# EasyEDA Pro project ProProject_STM32 2.4G无线遥控小车_2023-08-27.epro

# Schematic 遥控板（发送端）
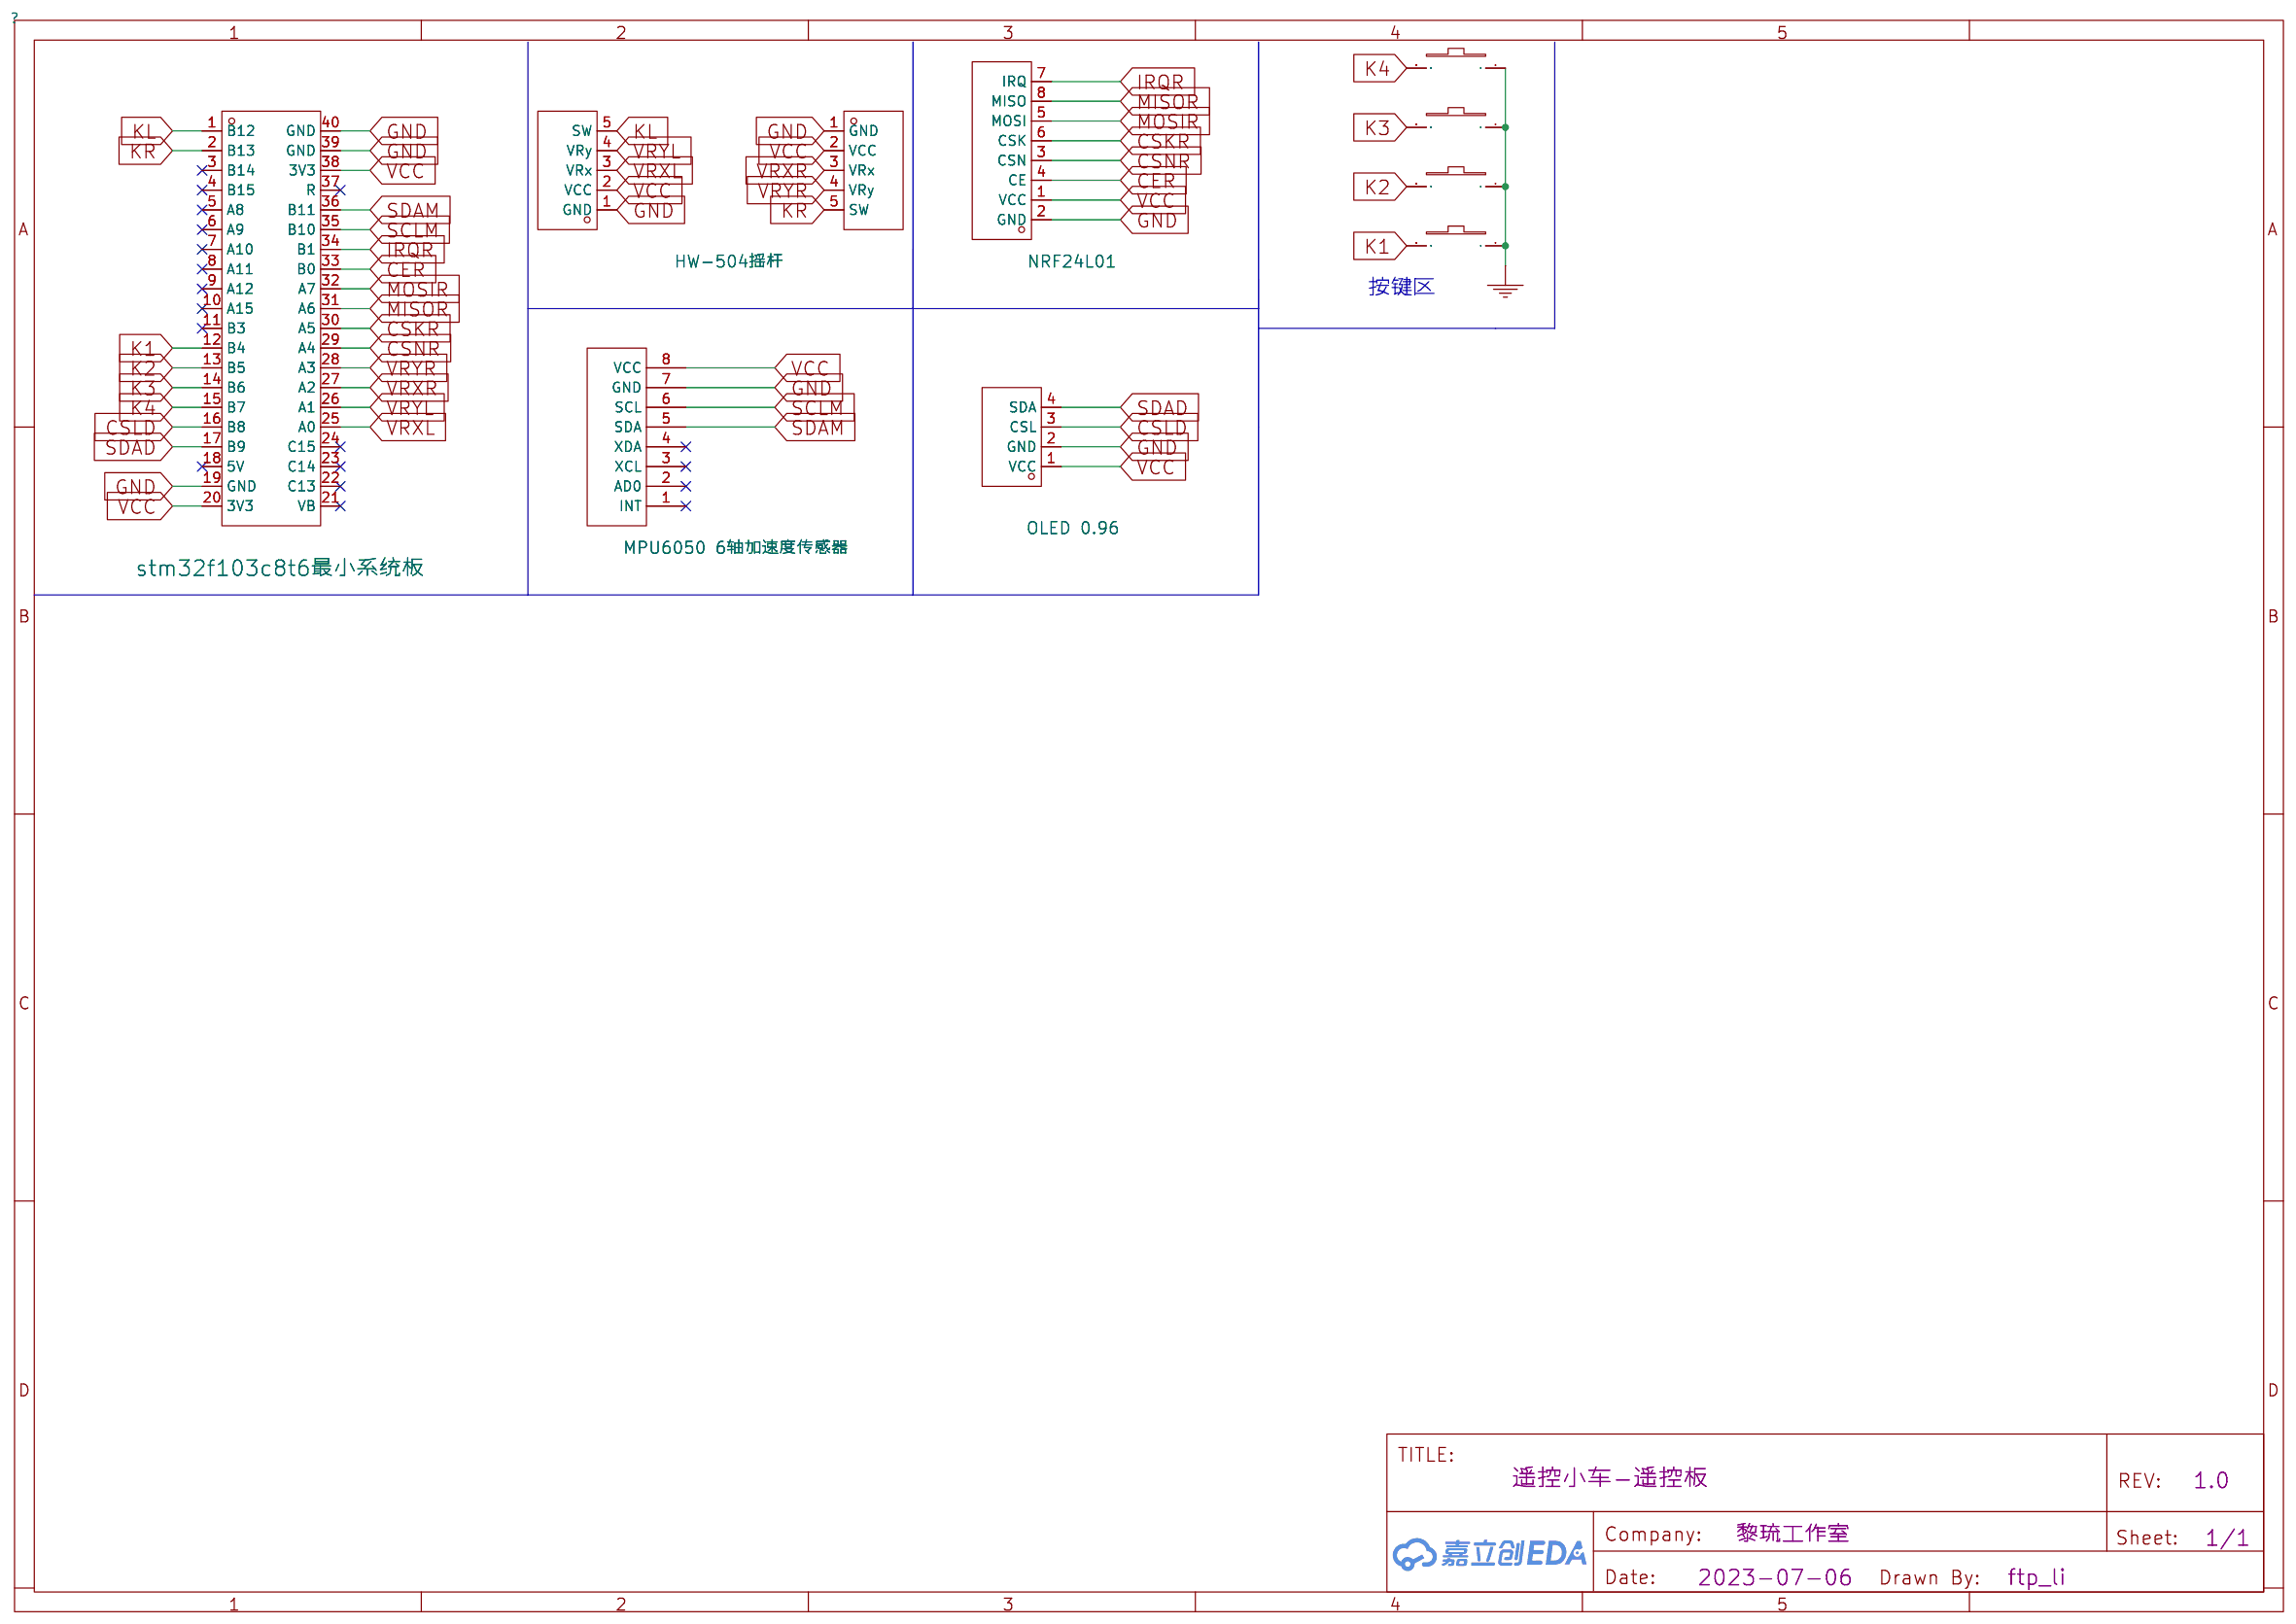
[diagram p0: schematic sheet]

## Parts
U3  stm32f103c8t6最小系统板  [STM32F103C8T6]
U7  HW-504摇杆  [5P]
U8  HW-504摇杆  [5P]
U9  MPU6050 6轴加速度传感器  [COMM-TH_MPU6050M]
U10  NRF24L01  [WIRELM-SMD_AI_NRF24L01]
U16  6*6 按键 微动开关  [DIP-6*6*7.5]
U17  6*6 按键 微动开关  [DIP-6*6*7.5]
U18  6*6 按键 微动开关  [DIP-6*6*7.5]
U21  OLED 0.96  [OLED-TH12864]
U24  6*6 按键 微动开关  [DIP-6*6*7.5]

## Library data of the parts
U3 = stm32f103c8t6最小系统板
U7 U8 = HW-504摇杆
U9 = MPU6050 6轴加速度传感器
U10 = NRF24L01
U16-U18 U24 = 6*6 按键 微动开关
U21 = OLED 0.96

## Nets
GND: U3.19(GND) U3.39(GND) U3.40(GND) U7.1(GND) U8.1(GND) U9.7(GND) U10.2(GND) U16.1 U17.1 U18.1 U21.2(GND) U24.1
VCC: U3.20(3V3) U3.38(3V3) U7.2(VCC) U8.2(VCC) U9.8(VCC) U10.1(VCC) U21.1(VCC)
CER: U3.33(B0) U10.4(CE)
CSKR: U3.30(A5) U10.6(CSK)
CSLD: U3.16(B8) U21.3(CSL)
CSNR: U3.29(A4) U10.3(CSN)
IRQR: U3.34(B1) U10.7(IRQ)
K1: U3.12(B4) U24.2
K2: U3.13(B5) U16.2
K3: U3.14(B6) U17.2
K4: U3.15(B7) U18.2
KL: U3.1(B12) U7.5(SW)
KR: U3.2(B13) U8.5(SW)
MISOR: U3.31(A6) U10.8(MISO)
MOSIR: U3.32(A7) U10.5(MOSI)
SCLM: U3.35(B10) U9.6(SCL)
SDAD: U3.17(B9) U21.4(SDA)
SDAM: U3.36(B11) U9.5(SDA)
VRXL: U3.25(A0) U7.3(VRx)
VRXR: U3.27(A2) U8.3(VRx)
VRYL: U3.26(A1) U7.4(VRy)
VRYR: U3.28(A3) U8.4(VRy)

Not connected (* = marked no-connect by the designer): U3 3(B14)* 4(B15)* 5(A8)* 6(A9)* 7(A10)* 8(A11)* 9(A12)* 10(A15)* 11(B3)* 18(5V)* 21(VB)* 22(C13)* 23(C14)* 24(C15)* 37(R)*; U9 1(INT)* 2(AD0)* 3(XCL)* 4(XDA)*

## Notes on the sheet
- 按键区

# Schematic 车载板（接收端）
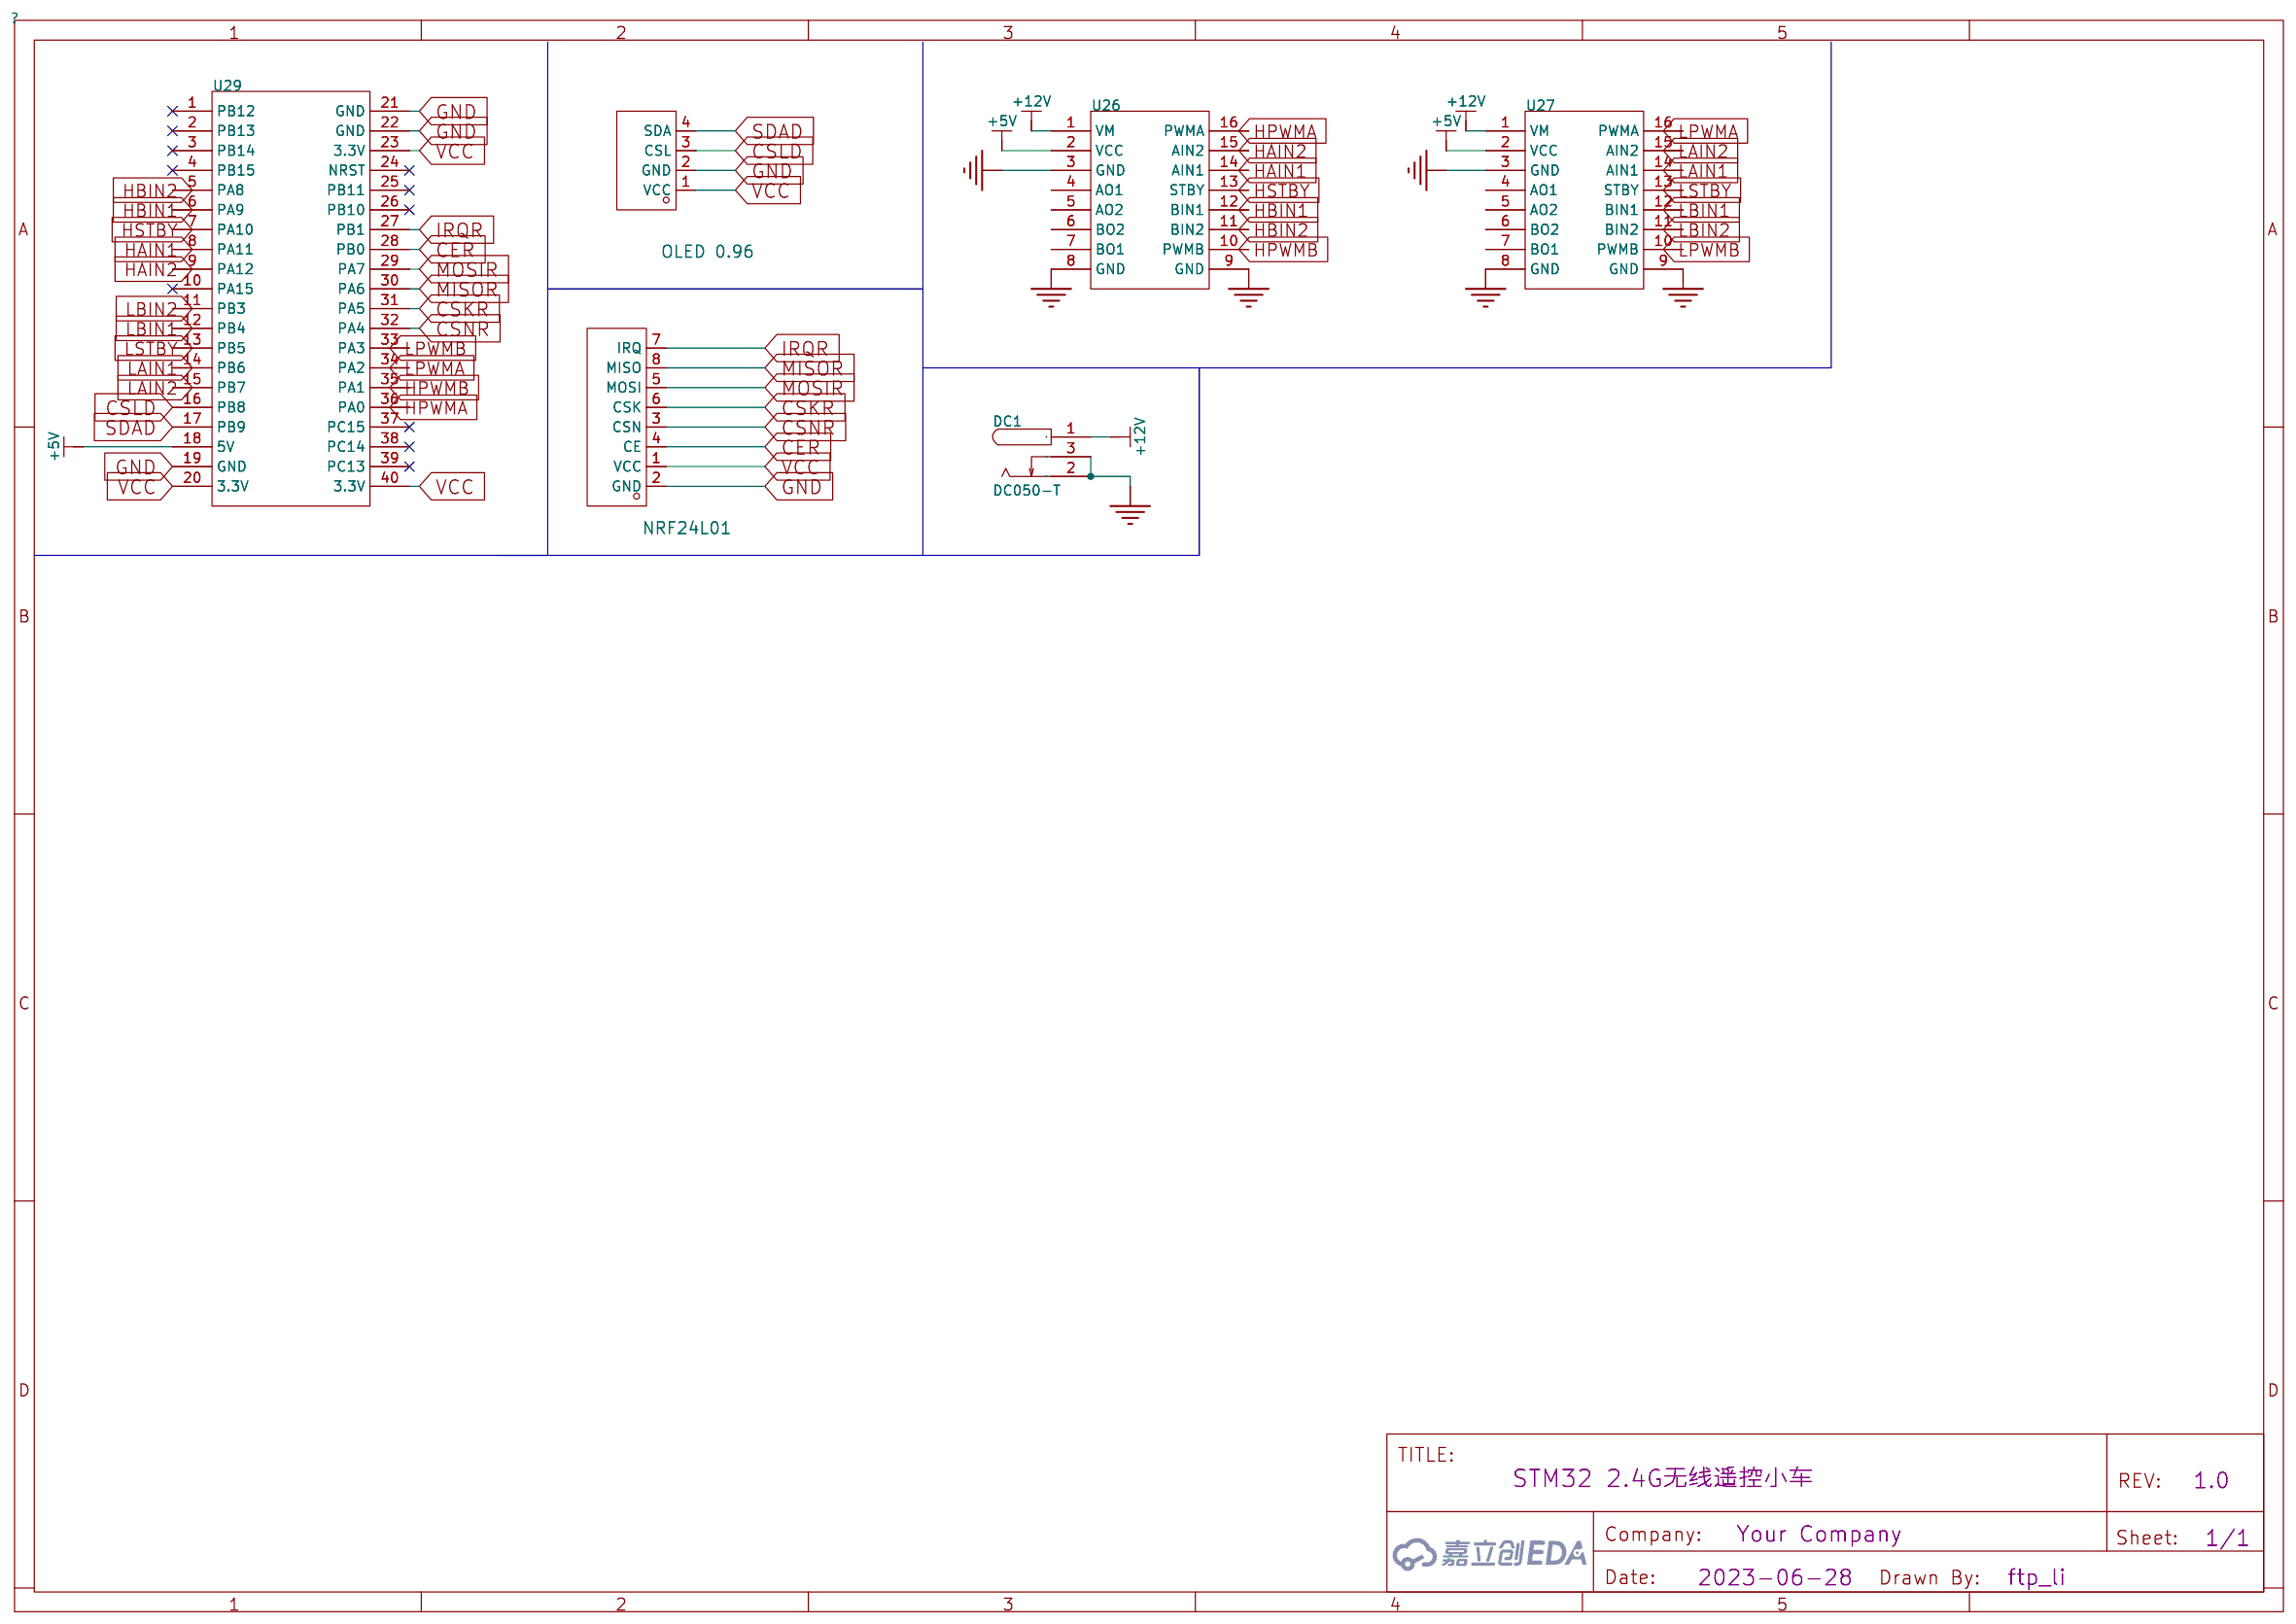
[diagram p1: schematic sheet]

## Parts
DC1  DC050-T  [DC-IN_DC050-T]
U4  NRF24L01  [nrf24l01]
U6  OLED 0.96  [OLED_0.96_IIC_1]
U26  -  [TB6612]
U27  -  [TB6612]
U29  -  [STM32F103C8T6]

## Library data of the parts
DC1 = DC050-T: 连接器类型:DC电源插座;安装方式:卧贴;触点内径:-;触点外径:6.4mm;额定电流:4A;额定电压:16V;工作温度范围:-;; LCSC Part Name: DC电源插座 外径:6.4mm 铜材质; Supplier Part: C431534; Manufacturer: SHOU HAN(首韩); Supplier Footprint: SMD; JLCPCB Part Class: 扩展库; Datasheet: https://atta.szlcsc.com/upload/public/pdf/source/20190925/C431534_67EA3B20454E00D5CD394807B04C56FF.pdf; Supplier: LCSC; Connector Type: DC电源插座; Mounting Style: 卧贴; Outside Contact Diameter: 6.4mm; Current Rating (Max): 4A; Voltage Rating (Max): 16V
U4 = NRF24L01
U6 = OLED 0.96
U26 U27 = TB6612
U29 = STM32F103C8T6最小系统

## Nets
+5V: U26.2(VCC) U27.2(VCC) U29.18(5V)
+12V: DC1.1 U26.1(VM) U27.1(VM)
GND: DC1.2 DC1.3 U4.2(GND) U6.2(GND) U26.3(GND) U26.8(GND) U26.9(GND) U27.3(GND) U27.8(GND) U27.9(GND) U29.19(GND) U29.21(GND) U29.22(GND)
VCC: U4.1(VCC) U6.1(VCC) U29.20(3.3V) U29.23(3.3V) U29.40(3.3V)
CER: U4.4(CE) U29.28(PB0)
CSKR: U4.6(CSK) U29.31(PA5)
CSLD: U6.3(CSL) U29.16(PB8)
CSNR: U4.3(CSN) U29.32(PA4)
HAIN1: U26.14(AIN1) U29.8(PA11)
HAIN2: U26.15(AIN2) U29.9(PA12)
HBIN1: U26.12(BIN1) U29.6(PA9)
HBIN2: U26.11(BIN2) U29.5(PA8)
HPWMA: U26.16(PWMA) U29.36(PA0)
HPWMB: U26.10(PWMB) U29.35(PA1)
HSTBY: U26.13(STBY) U29.7(PA10)
IRQR: U4.7(IRQ) U29.27(PB1)
LAIN1: U27.14(AIN1) U29.14(PB6)
LAIN2: U27.15(AIN2) U29.15(PB7)
LBIN1: U27.12(BIN1) U29.12(PB4)
LBIN2: U27.11(BIN2) U29.11(PB3)
LPWMA: U27.16(PWMA) U29.34(PA2)
LPWMB: U27.10(PWMB) U29.33(PA3)
LSTBY: U27.13(STBY) U29.13(PB5)
MISOR: U4.8(MISO) U29.30(PA6)
MOSIR: U4.5(MOSI) U29.29(PA7)
SDAD: U6.4(SDA) U29.17(PB9)

Not connected (* = marked no-connect by the designer): U26 4(AO1) 5(AO2) 6(BO2) 7(BO1); U27 4(AO1) 5(AO2) 6(BO2) 7(BO1); U29 1(PB12)* 2(PB13)* 3(PB14)* 4(PB15)* 10(PA15)* 24(NRST)* 25(PB11)* 26(PB10)* 37(PC15)* 38(PC14)* 39(PC13)*

# Board PCB遥控板（发送端）
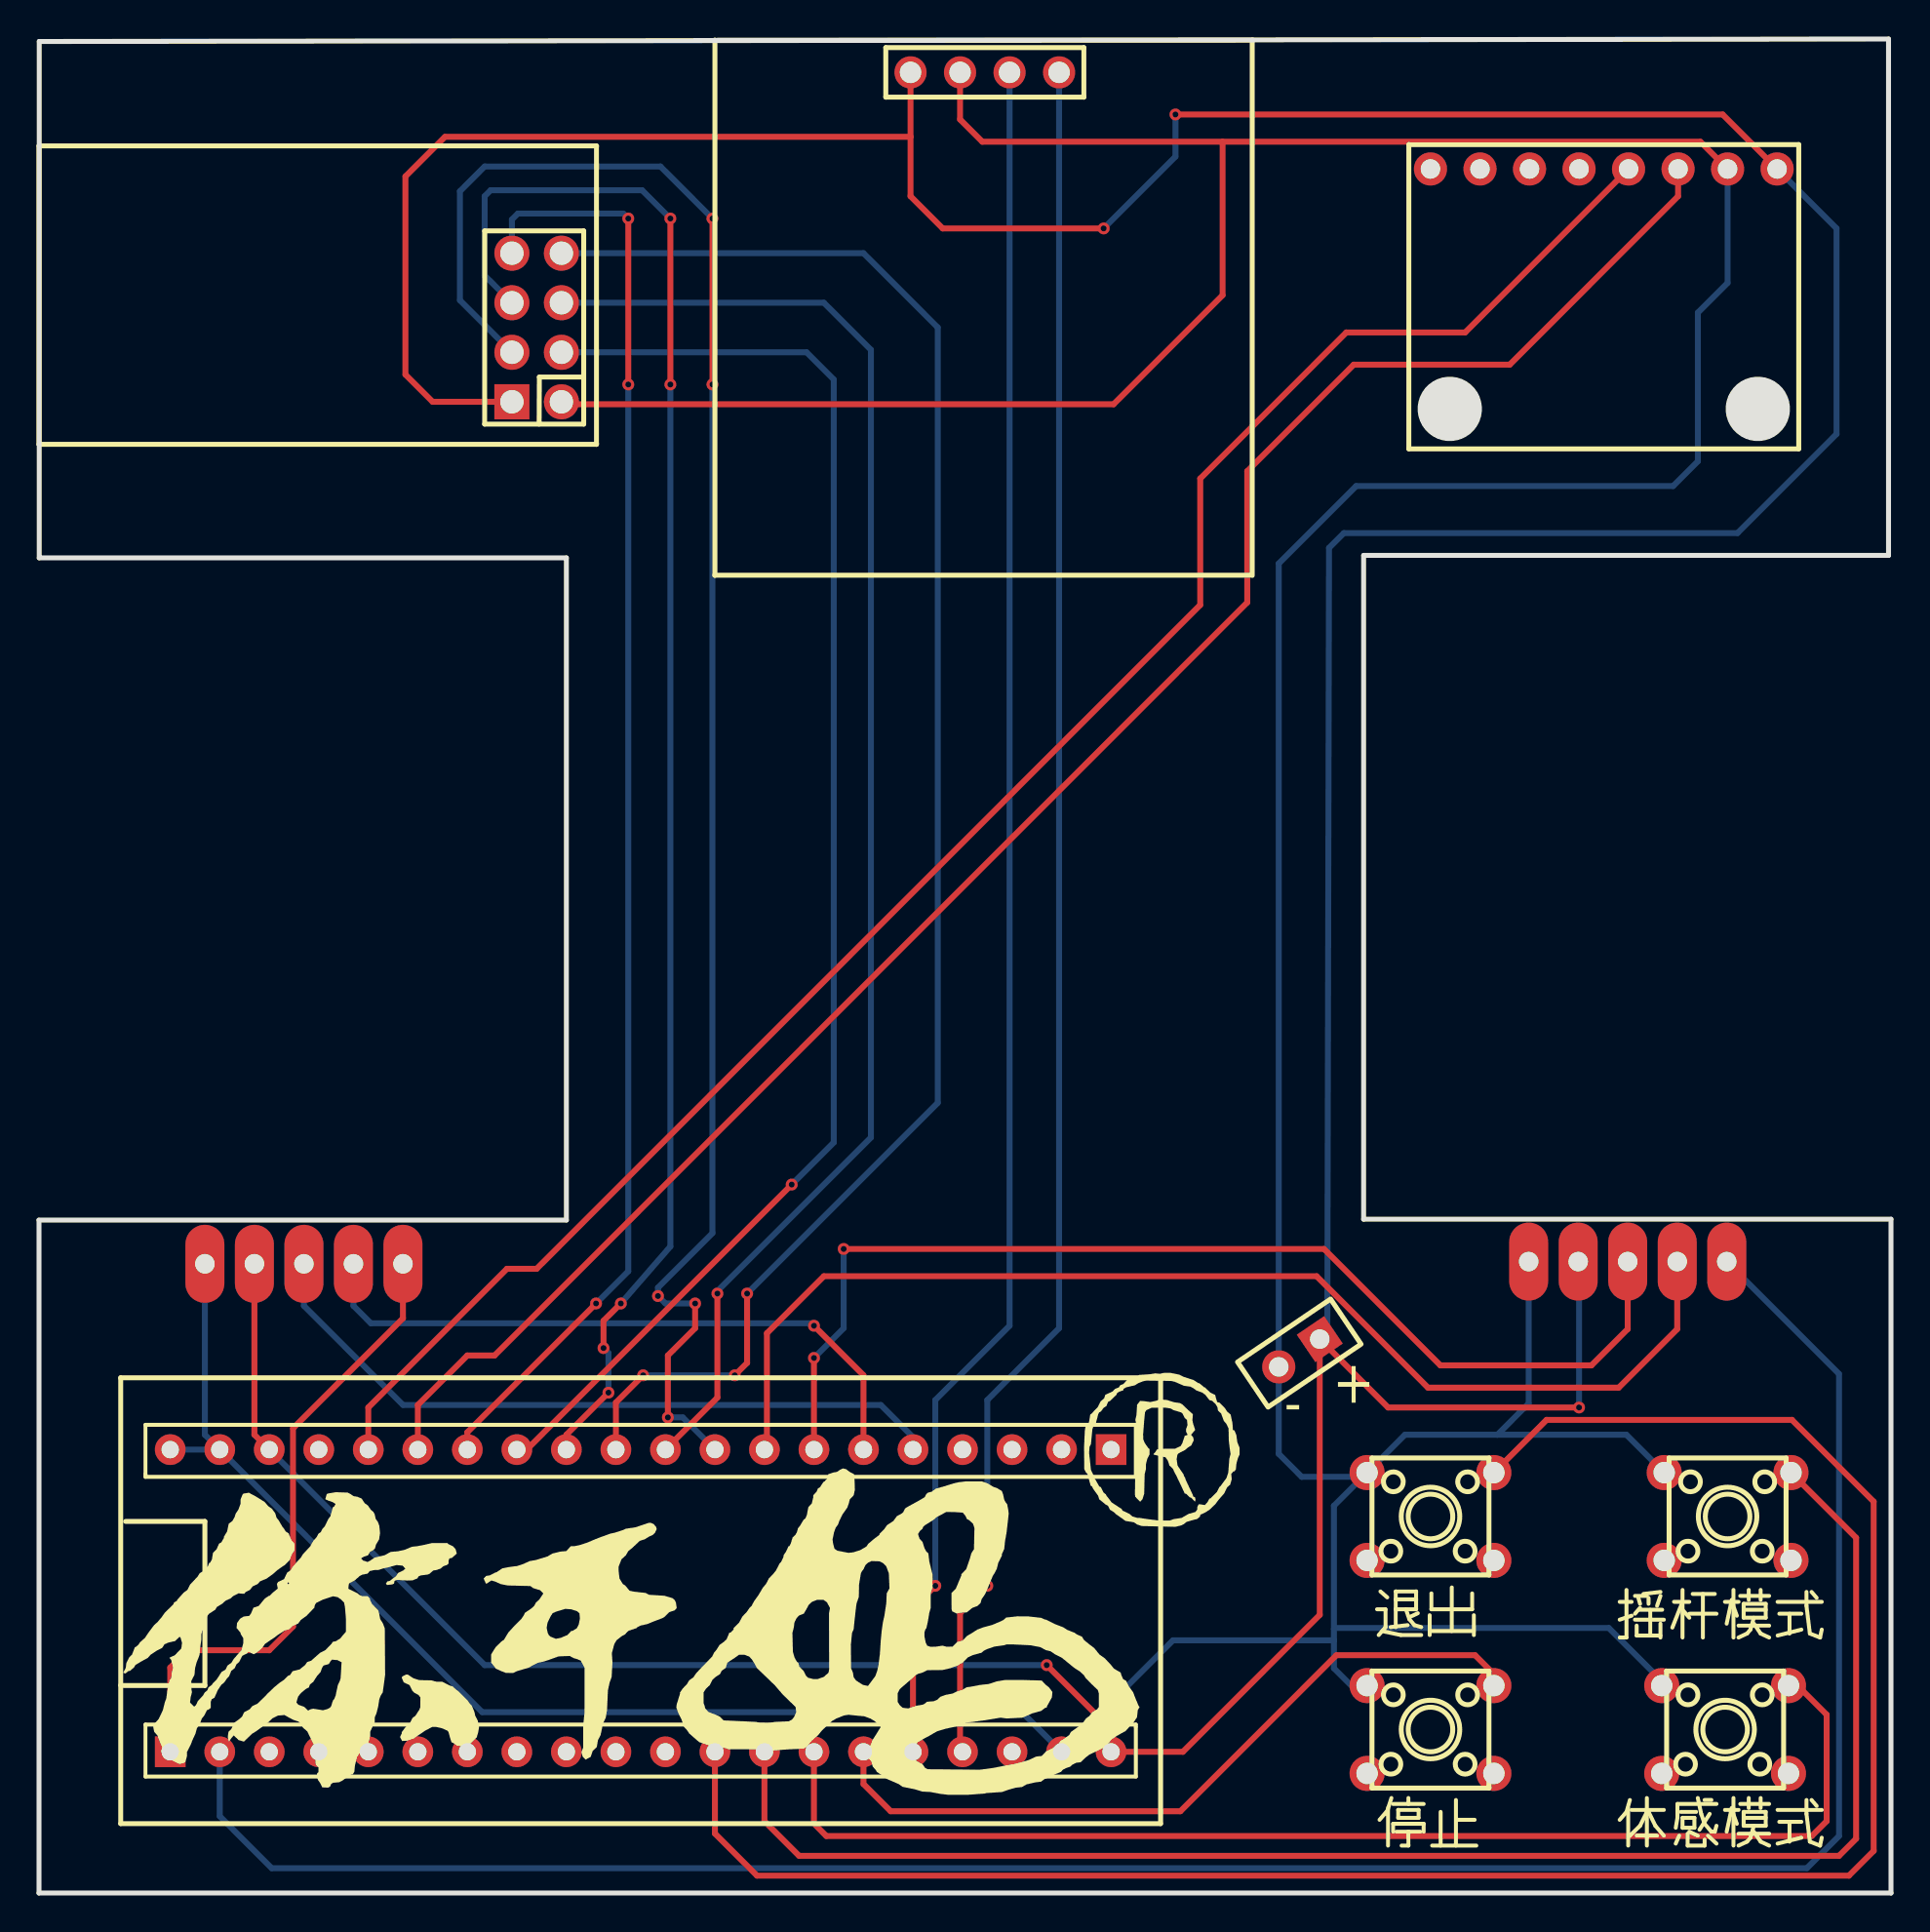
[diagram p2: board, top side]
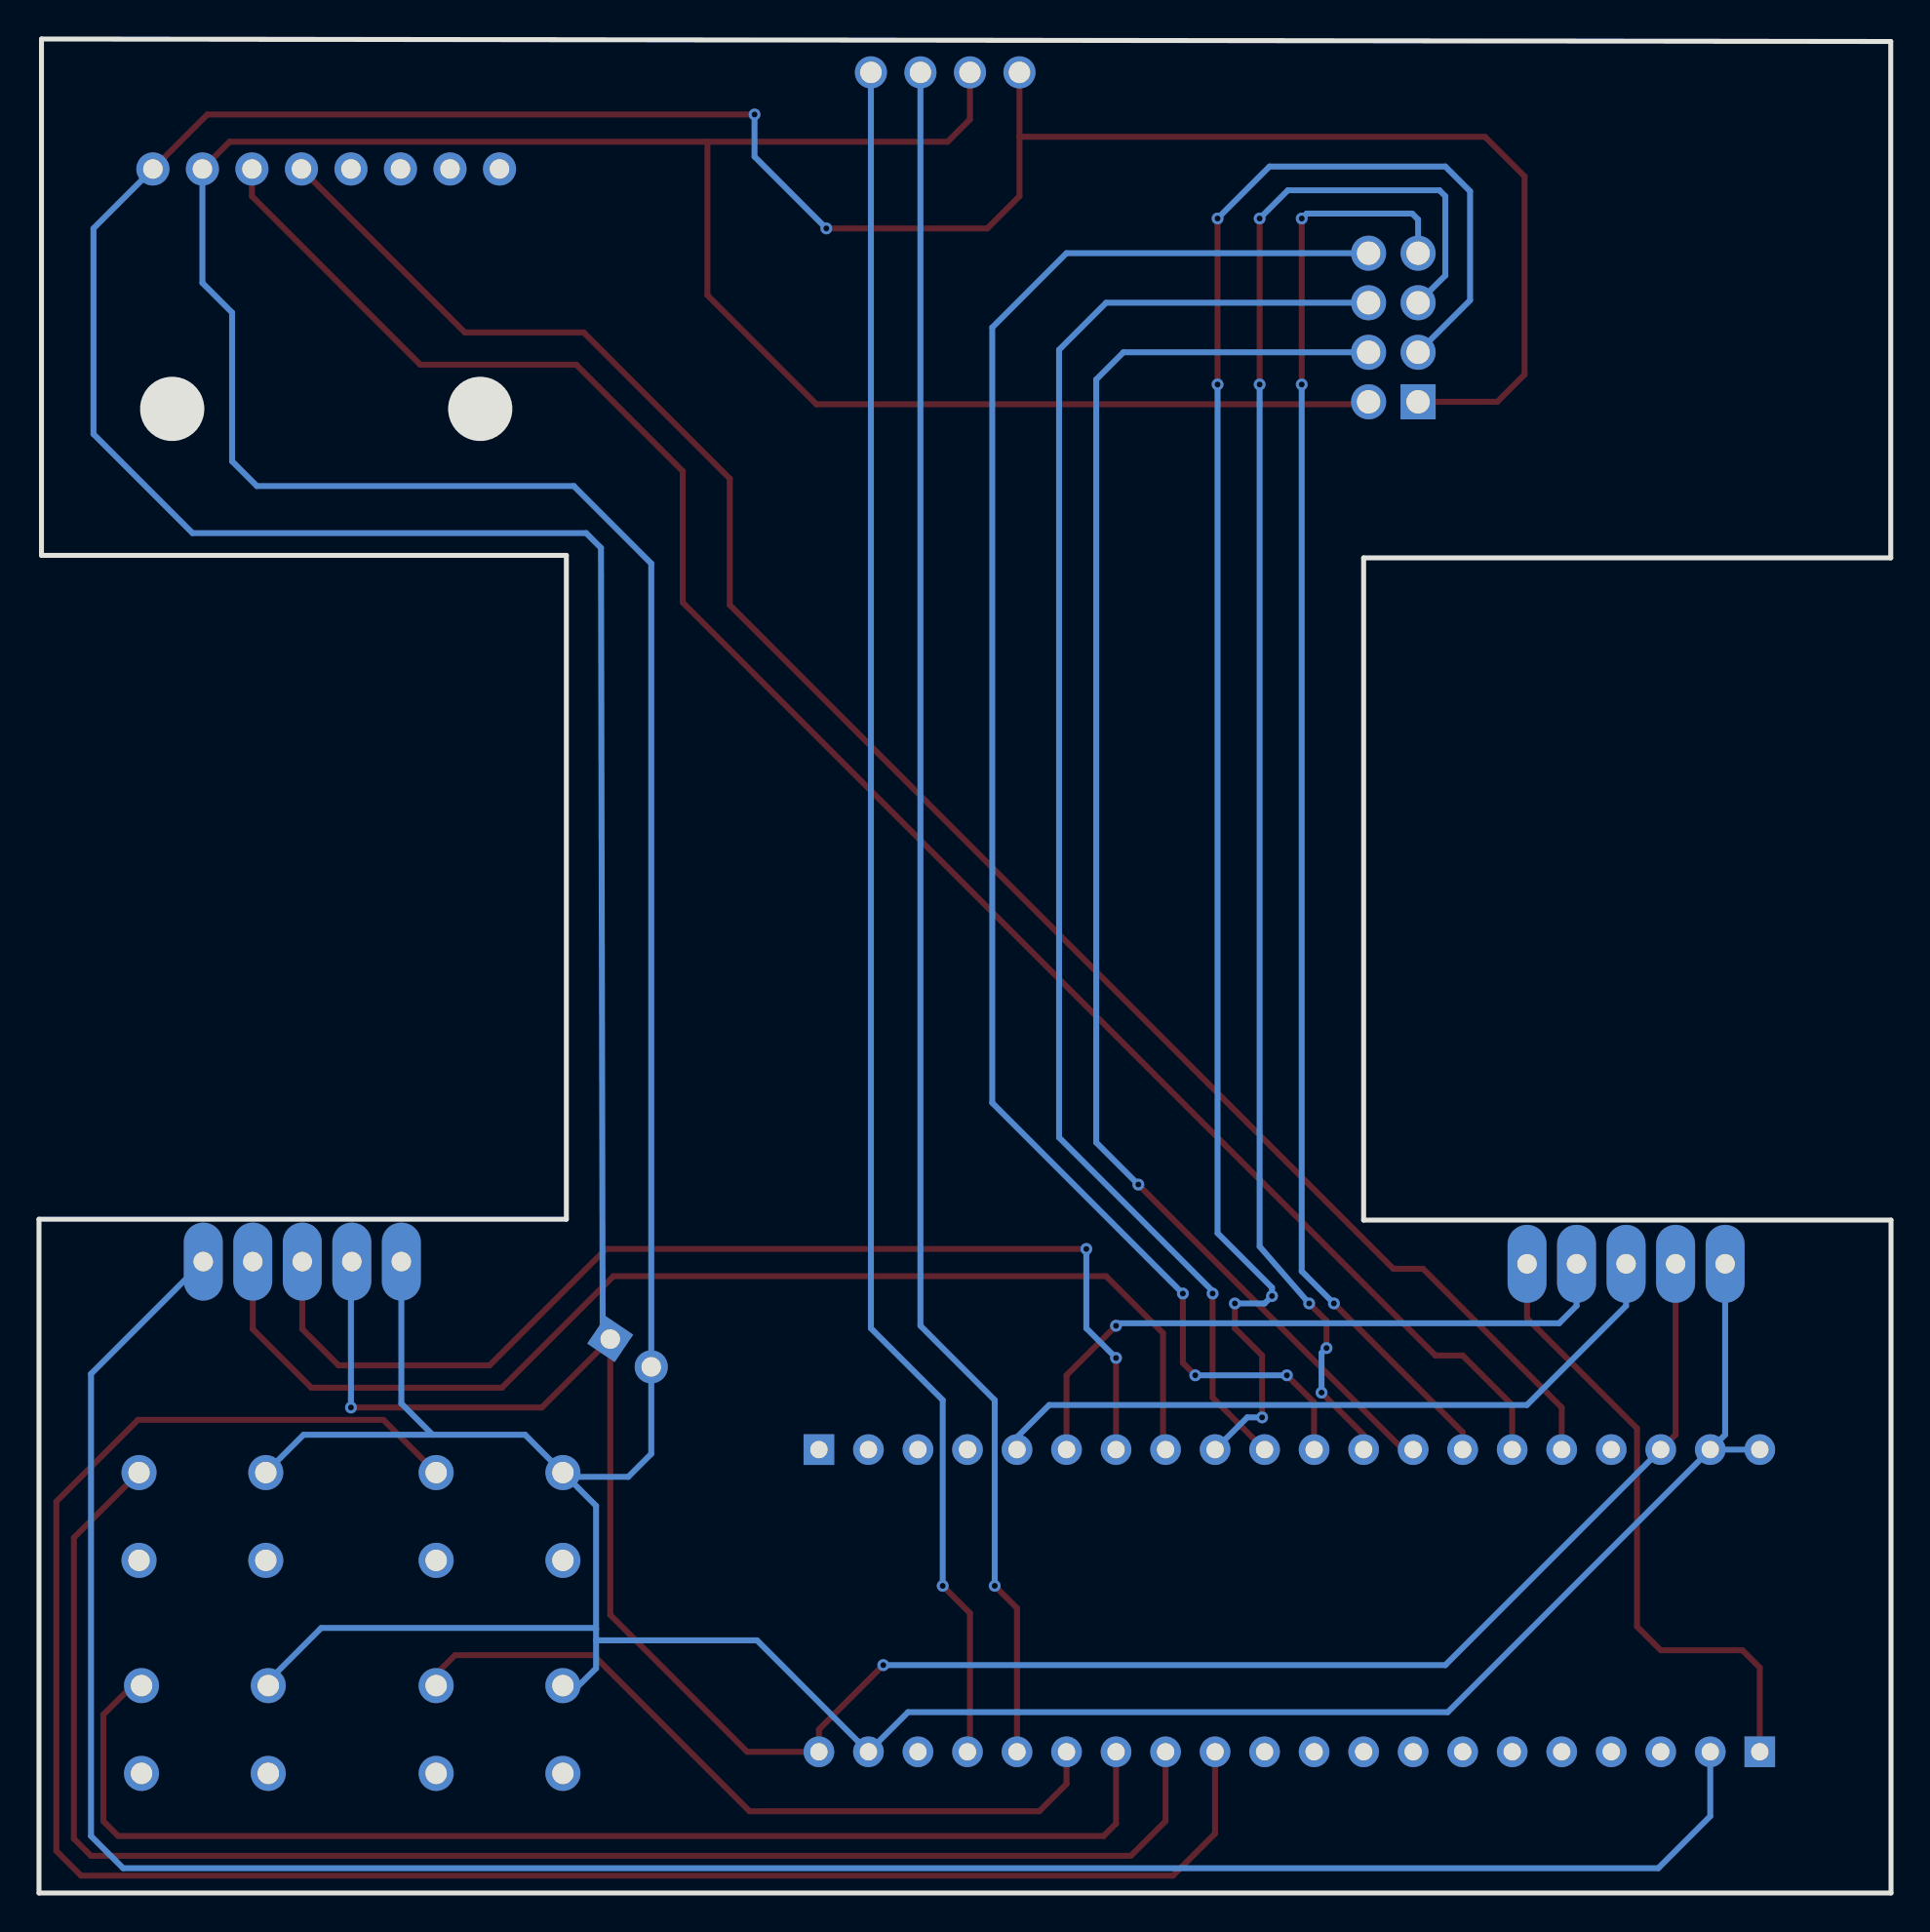
[diagram p3: board, bottom side, seen from below]

Outline 95 x 95.06 mm; copper layers: Top Layer, Bottom Layer. Coordinates in mm from the lower left corner of the outline.
Outline path: 0,34.5 27.05,34.5 27.05,68.45 0.01,68.45 0.01,94.93 94.87,95.06 94.87,68.58 67.94,68.58 67.94,34.54 95,34.54 95,0 0,0 0,34.5
Stack: Top Layer 0.035mm / Dielectric1 1.51mm FR4 er 4.5 / Bottom Layer 0.035mm

## Design rules (mm)
spacing Default (default): track to track 0.152, other pairs 0 to 0.152
track width Default (default): min 0.305, default 0.305, max 25.4
differential pair differentialPair (default): width min 0.127, default 0.254, max 2.54; gap min 0.152, default 0.152
via Default (default): diameter min 0.61, default 0.61, max 100.025; hole min 0.305, default 0.305, max 59.995

## Placement (name value [footprint] x y rotation side)
H1  -  [HDR-TH_2P-P2.54-V-F]  64.64 27.69 214.1 top
U3  stm32f103c8t6最小系统板  [STM32F103C8T6]  31.5 15.49 90 top
U7  HW-504摇杆  [5P]  13.59 32.26 90 top
U8  HW-504摇杆  [5P]  81.49 32.37 90 top
U9  MPU6050 6轴加速度传感器  [COMM-TH_MPU6050M]  80.26 88.39 0 top
U10  NRF24L01  [WIRELM-SMD_AI_NRF24L01]  25.53 80.26 180 top
U16  6*6 按键 微动开关  [DIP-6*6*7.5]  86.61 19.3 0 top
U17  6*6 按键 微动开关  [DIP-6*6*7.5]  86.49 8.38 0 top
U18  6*6 按键 微动开关  [DIP-6*6*7.5]  71.37 8.38 0 top
U21  OLED 0.96  [OLED-TH12864]  48.51 93.34 0 top
U24  6*6 按键 微动开关  [DIP-6*6*7.5]  71.37 19.3 0 top

## Footprints (pads in the part's own frame, mm; a bottom-side part is the same pattern mirrored in y, then rotated)
5P
  oval 4x2 hole 1x1: 1(0,5.08) 2(0,2.54) 3(0,0) 4(0,-2.54) 5(0,-5.08)
COMM-TH_MPU6050M
  round 1.7 hole 1: 1(-8.89,0) 2(-6.35,0) 3(-3.81,0) 4(-1.27,0) 5(1.27,0) 6(3.81,0) 7(6.35,0) 8(8.89,0)
DIP-6*6*7.5
  round 1.8 hole 1.1: 1(-3.251,2.251) 2(3.251,2.251) 3(-3.251,-2.251) 4(3.251,-2.251)
HDR-TH_2P-P2.54-V-F
  rect 1.7x1.7 hole 1: 1(-1.27,0)
  round 1.7 hole 1: 2(1.27,0)
OLED-TH12864
  round 1.65 hole 1.1: 1(-3.81,0) 2(-1.27,0) 3(1.27,0) 4(3.81,0)
STM32F103C8T6
  rect 1.575x1.575 hole 0.889: 1(-8.255,24.765) 21(7.239,-23.495)
  round 1.575 hole 0.889: 2(-8.255,22.225) 3(-8.255,19.685) 4(-8.255,17.145) 5(-8.255,14.605) 6(-8.255,12.065) 7(-8.255,9.525) 8(-8.255,6.985) 9(-8.255,4.445) 10(-8.255,1.905) 11(-8.255,-0.635) 12(-8.255,-3.175) 13(-8.255,-5.715) 14(-8.255,-8.255) 15(-8.255,-10.795) 16(-8.255,-13.335) 17(-8.255,-15.875) 18(-8.255,-18.415) 19(-8.255,-20.955) 20(-8.255,-23.495) 22(7.239,-20.955) 23(7.239,-18.415) 24(7.239,-15.875) 25(7.239,-13.335) 26(7.239,-10.795) 27(7.239,-8.255) 28(7.239,-5.715) 29(7.239,-3.175) 30(7.239,-0.635) 31(7.239,1.905) 32(7.239,4.445) 33(7.239,6.985) 34(7.239,9.525) 35(7.239,12.065) 36(7.239,14.605) 37(7.239,17.145) 38(7.239,19.685) 39(7.239,22.225) 40(7.239,24.765)
WIRELM-SMD_AI_NRF24L01
  rect 1.8x1.8 hole 1.2: 1(1.27,3.808)
  round 1.8 hole 1.2: 2(-1.27,3.81) 3(1.27,1.27) 4(-1.27,1.27) 5(1.27,-1.27) 6(-1.27,-1.27) 7(1.27,-3.81) 8(-1.27,-3.81)

## Nets
As in the schematic, except:
GND: H1.2 U3.19 U3.39 U3.40 U7.1 U8.1 U9.7 U10.2 U16.1 U17.1 U18.1 U21.2 U24.1
VCC: H1.1 U3.20 U3.38 U7.2 U8.2 U9.8 U10.1 U21.1

Pads without a net: U3 3 4 5 6 7 8 9 10 11 18 21 22 23 24 37; U9 1 2 3 4; U16 3 4; U17 3 4; U18 3 4; U24 3 4

## Via types
v1: diameter 0.61, hole 0.305, Top Layer to Bottom Layer, 27 vias

## Routing (per net, layer and track width the routed paths; a pad name or vN(x,y) marks a point on that pad's centre or on a via; arc(x,y) is an arc through that point)
GND: length 312.7
  Top Layer w0.305: 60.71,89.79 48.39,89.79 47.24,90.93 U21.2 ; 60.71,89.79 60.71,81.92 55.12,76.33 26.92,76.33 U10.2 ; 60.71,89.79 85.22,89.79 U9.7
  Bottom Layer w0.305: 66.42,12.95 58.17,12.95 U3.19 50.42,9.27 22.73,9.27 U3.39 ; 66.42,12.95 66.42,11.52 67.69,10.25 68.12,10.25 ; 66.42,12.95 66.42,13.53 ; U7.1 8.51,23.5 U3.39 ; U3.39 U3.40 ; 74.8,23.5 81.42,23.5 U16.1 ; 74.8,23.5 76.41,25.1 U8.1 ; 74.8,23.5 70.06,23.5 U24.1 67.9,21.34 ; U9.7 86.61,82.55 85.09,81.03 85.09,73.41 83.82,72.14 67.56,72.14 63.59,68.16 H1.2 63.59,22.52 64.77,21.34 67.9,21.34 ; 67.9,21.34 66.42,19.85 66.42,13.53 ; 66.42,13.53 66.48,13.59 80.52,13.59 83.36,10.74 83.36,10.63
VCC: length 293.4
  Top Layer w0.305: 44.7,90.04 20.83,90.04 18.8,88.01 18.8,77.85 20.19,76.46 U10.1 ; 44.7,90.04 44.7,87 46.35,85.34 v1(54.61,85.34) ; 44.7,90.04 U21.1 ; v1(78.99,24.89) 69.2,24.89 65.69,28.4 65.69,14.26 58.67,7.24 U3.20 54.99,8.38 v1(51.69,11.68) ; U3.38 11.05,23.5 U7.2 ; v1(58.29,91.19) 86.36,91.19 U9.8
  Bottom Layer w0.305: U8.2 78.99,32.33 v1(78.99,24.89) ; U9.8 92.2,85.34 92.2,74.8 87.12,69.72 66.93,69.72 66.17,68.96 66.08,28.78 65.69,28.4 ; v1(51.69,11.68) 22.86,11.68 U3.38 ; v1(58.29,91.19) 58.29,89.03 v1(54.61,85.34)
CER: length 76.4
  Top Layer w0.305: v1(38.61,36.32) 25.02,22.73 U3.33
  Bottom Layer w0.305: U10.4 39.37,78.99 40.77,77.6 40.77,38.48 v1(38.61,36.32)
CSKR: length 77.6
  Top Layer w0.305: U3.30 34.8,25.4 v1(34.8,30.73)
  Bottom Layer w0.305: U10.6 40.26,81.53 42.67,79.12 42.67,38.73 34.8,30.86 v1(34.8,30.73)
CSLD: length 88.2
  Top Layer w0.305: v1(45.97,15.75) 44.83,14.6 U3.16
  Bottom Layer w0.305: v1(45.97,15.75) 45.97,25.27 49.78,29.08 U21.3
CSNR: length 91.8
  Top Layer w0.305: v1(34.54,85.85) 34.54,77.47 ; v1(33.66,30.23) 33.66,28.96 32.26,27.56 v1(32.26,24.38)
  Bottom Layer w0.305: U10.3 21.59,81.66 21.59,87.25 22.86,88.52 31.88,88.52 v1(34.54,85.85) ; v1(32.26,24.38) 33.02,24.38 U3.29 ; v1(34.54,77.34) 34.54,33.83 31.75,31.04 v1(31.75,30.61) 32.13,30.23 v1(33.66,30.23)
IRQR: length 74.5
  Top Layer w0.305: v1(30.23,85.85) v1(30.23,77.34) ; v1(28.57,30.23) 21.97,23.62 U3.34
  Bottom Layer w0.305: v1(28.57,30.23) 30.23,31.88 v1(30.23,77.34) ; v1(30.23,85.85) 29.97,86.11 24.56,86.11 24.26,85.8 U10.7
K1: length 105.3
  Top Layer w0.305: U24.2 77.33,24.26 89.92,24.26 94.11,20.07 94.11,2.16 92.84,0.89 36.83,0.89 34.67,3.05 U3.12
K2: length 80.8
  Top Layer w0.305: U3.13 37.21,3.68 38.99,1.91 92.33,1.91 93.21,2.78 93.21,18.21 U16.2
K3: length 64.1
  Top Layer w0.305: U3.14 39.75,3.56 40.39,2.92 90.93,2.92 91.69,3.68 91.69,9.14 90.17,10.67 89.9,10.67 89.87,10.63
K4: length 38.9
  Top Layer w0.305: U3.15 42.29,5.59 43.69,4.19 58.55,4.19 66.55,12.19 73.66,12.19 74.62,11.23 U18.2
KL: length 32.4
  Top Layer w0.305: U7.5 18.67,29.46 13.03,23.83 13.03,13.66 11.81,12.45 7.62,12.45 6.73,11.56 U3.1
KR: length 120
  Bottom Layer w0.305: U3.2 9.27,3.94 11.94,1.27 90.68,1.27 92.33,2.92 92.33,26.61 U8.5
MISOR: length 88
  Top Layer w0.305: v1(35.69,26.54) 36.32,27.18 v1(36.32,30.73) ; v1(30.99,26.54) 29.59,25.15 U3.31
  Bottom Layer w0.305: v1(36.32,30.73) 46.1,40.51 46.1,80.26 42.29,84.07 U10.8 ; v1(35.69,26.54) v1(30.99,26.54)
MOSIR: length 81.7
  Top Layer w0.305: v1(32.38,85.85) v1(32.38,77.34) ; v1(29.84,30.23) 28.96,29.34 v1(28.96,27.94) ; U3.32 27.05,23.5 v1(29.21,25.65)
  Bottom Layer w0.305: v1(28.96,27.94) 29.21,27.69 v1(29.21,25.65) ; v1(32.38,77.34) 32.38,33.15 v1(29.84,30.23) ; v1(32.38,85.85) 30.94,87.3 23.17,87.3 22.86,87 22.86,82.93 U10.5
SCLM: length 97.9
  Top Layer w0.305: U3.35 19.43,25.02 21.97,27.56 23.37,27.56 61.98,66.17 61.98,72.9 67.44,78.36 75.44,78.36 84.07,87 U9.6
SDAD: length 88.3
  Top Layer w0.305: U3.17 47.24,7.37 47.24,14.35 v1(48.64,15.75)
  Bottom Layer w0.305: v1(48.64,15.75) 48.64,25.27 52.32,28.96 U21.4
SDAM: length 96.9
  Top Layer w0.305: U9.5 73.15,80.01 67.06,80.01 59.56,72.52 59.56,66.04 25.53,32 24,32 16.89,24.89 U3.36
VRXL: length 36.8
  Bottom Layer w0.305: U3.25 44.83,23.37 43.18,25.02 18.68,25.02 13.59,30.11 U7.3
VRXR: length 57.8
  Top Layer w0.305: v1(41.28,33.02) 65.91,33.02 71.88,27.05 79.63,27.05 81.49,28.91 U8.3 ; v1(39.75,27.43) U3.27
  Bottom Layer w0.305: v1(41.28,33.02) 41.28,28.96 v1(39.75,27.43)
VRYL: length 33.6
  Top Layer w0.305: v1(39.75,29.08) 42.29,26.54 U3.26
  Bottom Layer w0.305: v1(39.75,29.08) 39.62,29.21 17.02,29.21 16.13,30.11 U7.4
VRYR: length 61
  Top Layer w0.305: U3.28 37.34,22.86 37.34,28.7 40.26,31.62 65.53,31.62 71.25,25.91 81.03,25.91 84.03,28.91 U8.4

## Text on the board
Top Silkscreen Layer: - | + | 退出 | 停止 | 摇杆模式 | 体感模式

# Board PCB车载板（接收端）
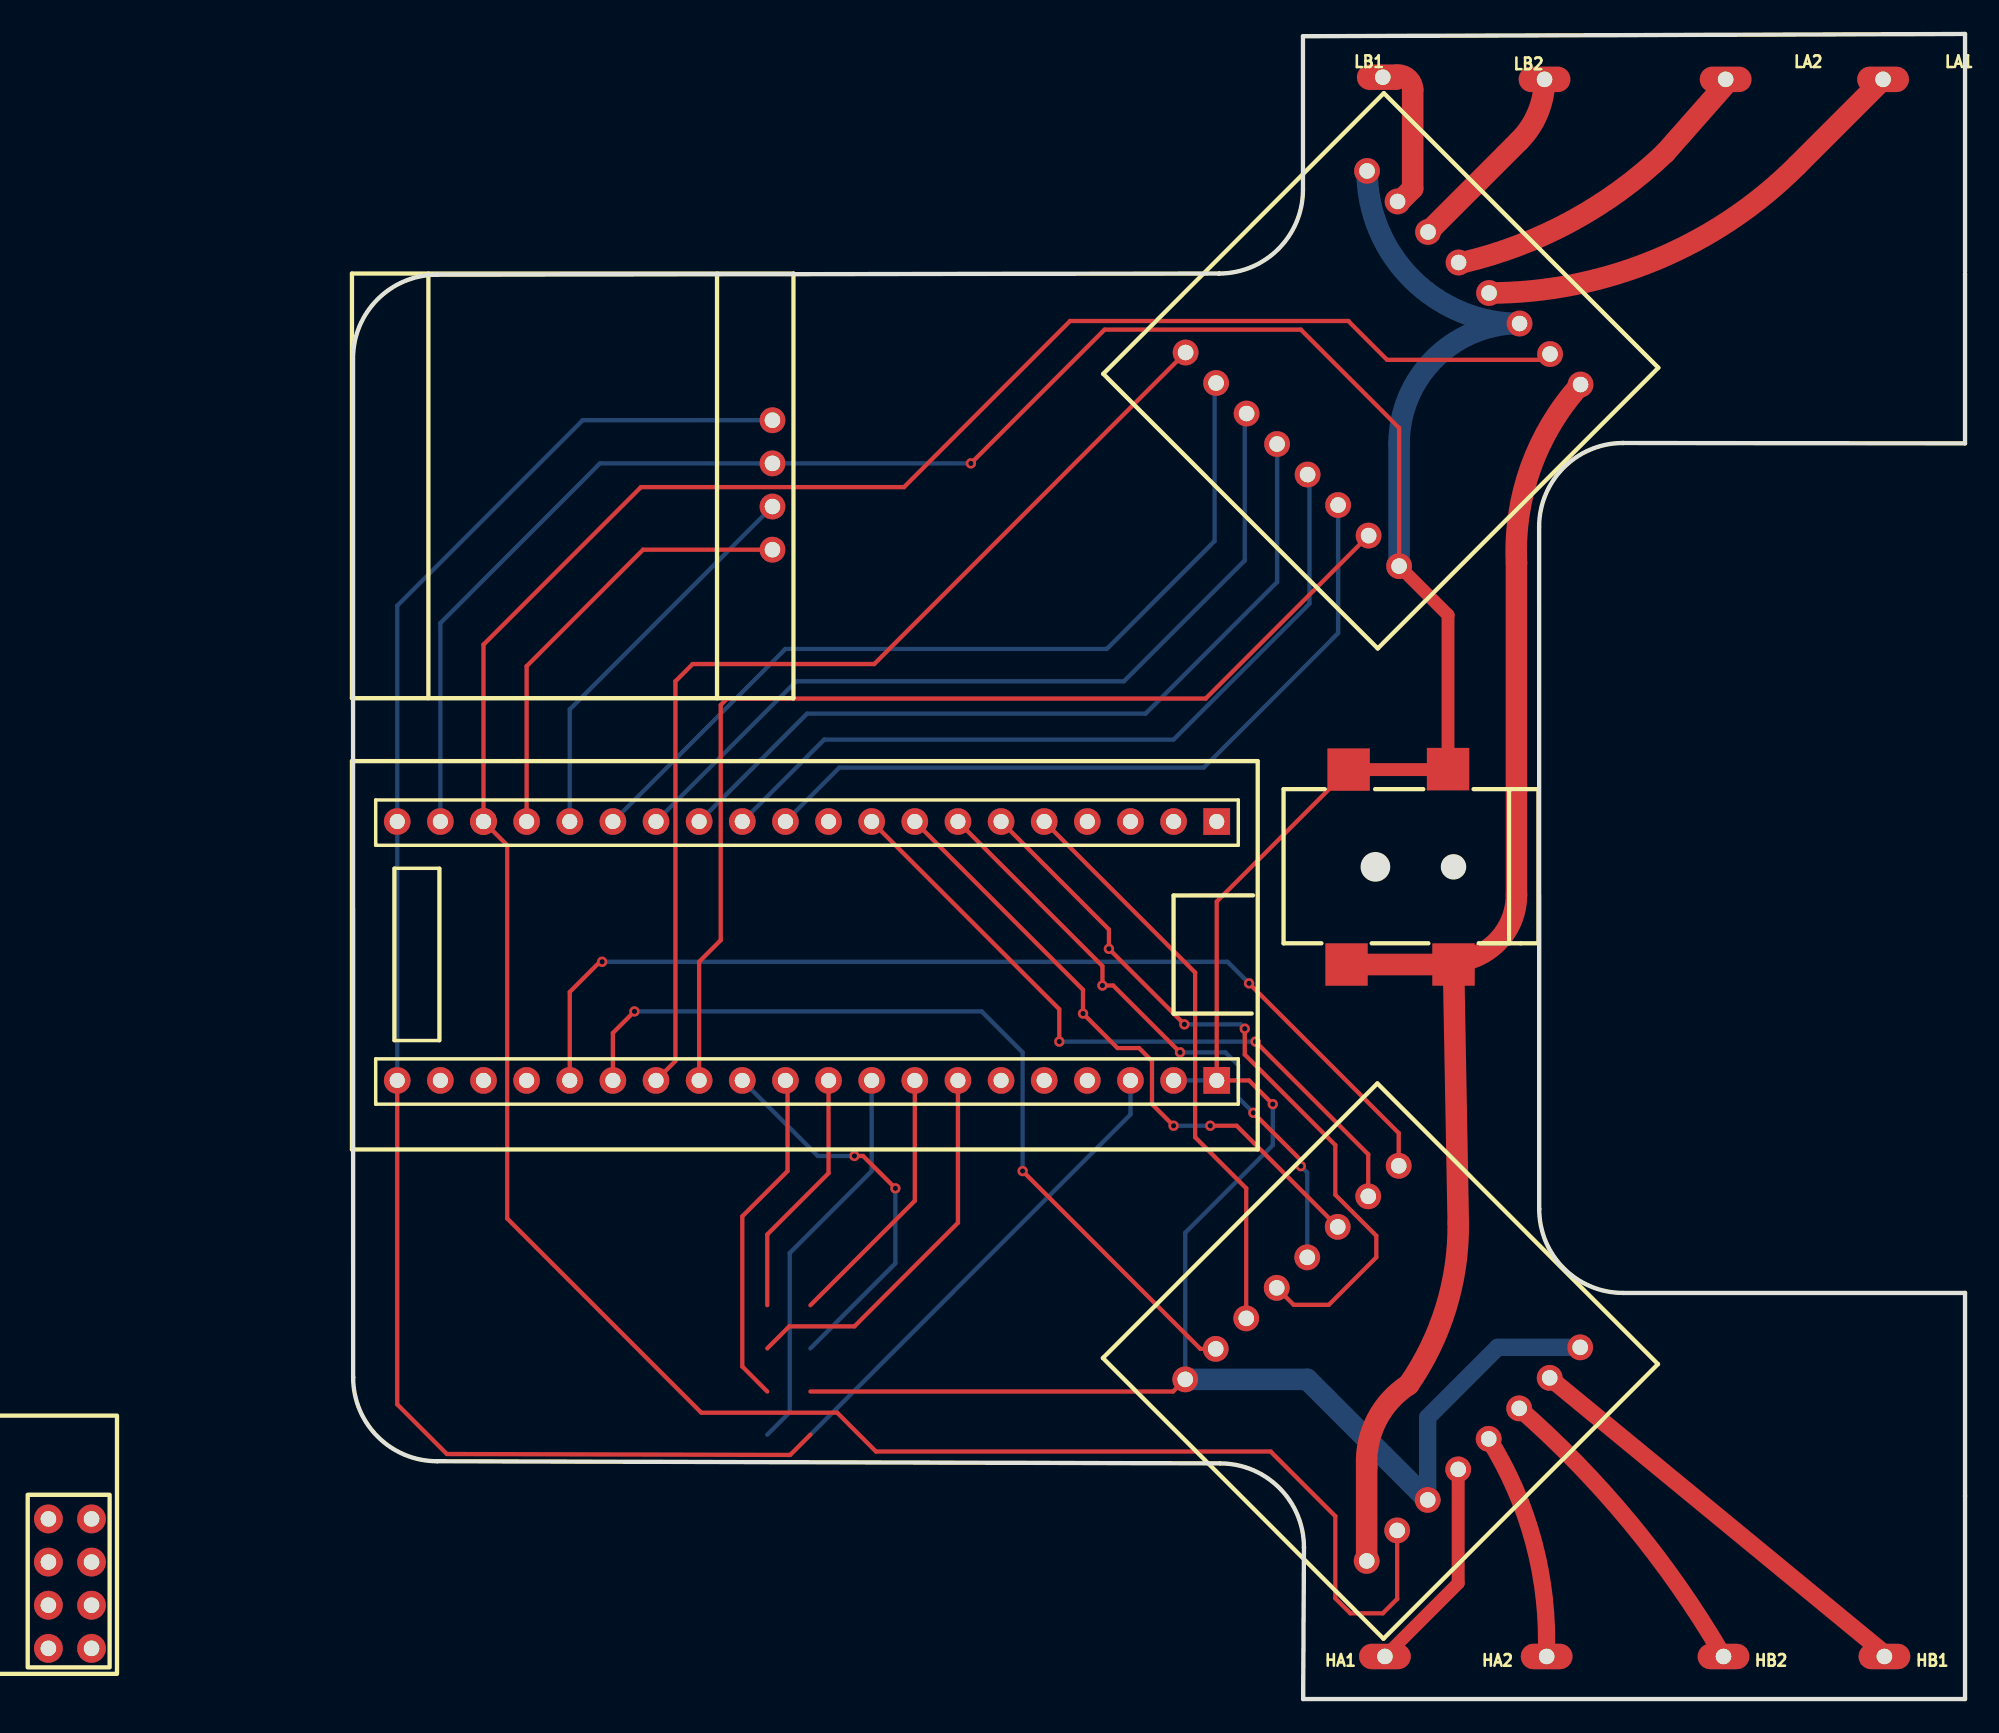
[diagram p4: board, top side]
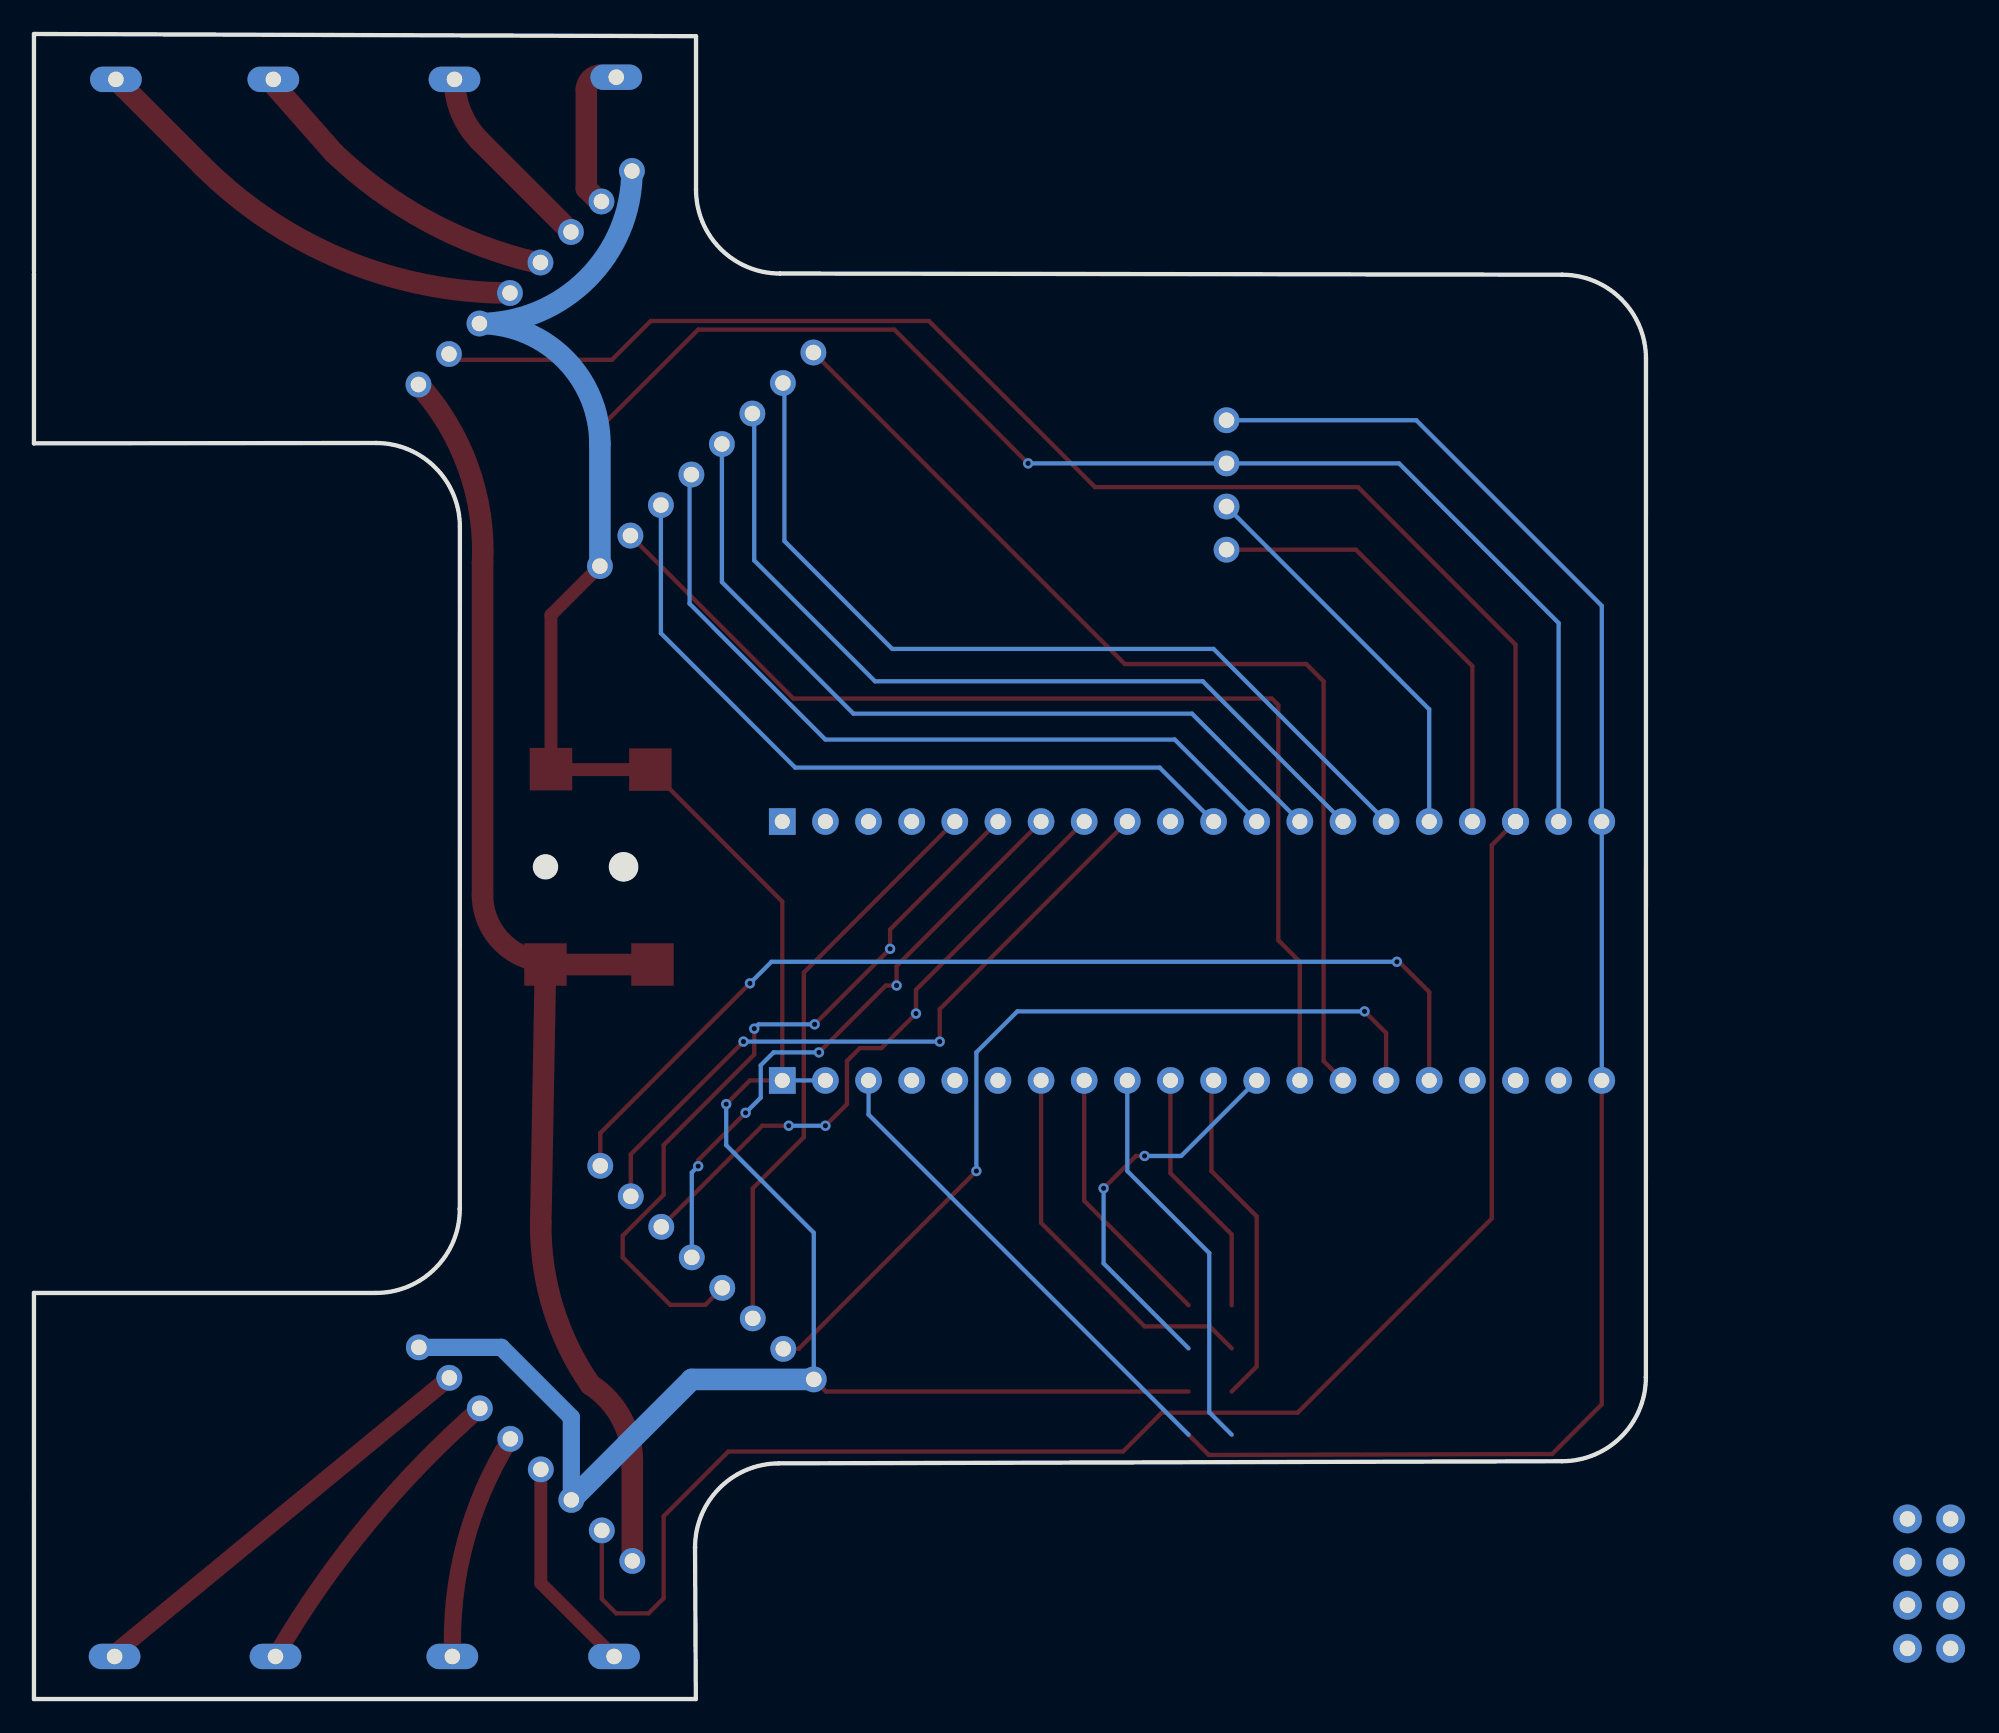
[diagram p5: board, bottom side, seen from below]

Outline 94.93 x 98.01 mm; copper layers: Top Layer, Inner1, Inner2, Inner3, Inner4, Inner5, Inner6, Inner7, Inner8, Inner9, Inner10, Inner11, Inner12, Inner13, Inner14, Inner15, Inner16, Inner17, Inner18, Inner19, Inner20, Inner21, Inner22, Inner23, Inner24, Inner25, Inner26, Inner27, Inner28, Inner29, Inner30, Bottom Layer. Coordinates in mm from the lower left corner of the outline.
Outline path: 51,83.91 4.95,83.84 4.94,83.84 arc(1.45,82.39) 0,78.9 0.01,18.95 0.01,18.94 arc(1.45,15.45) 4.95,14 51.06,13.87 arc(54.55,12.42) 56,8.93 ; 51,83.91 50.99,83.91 ; 51,83.91 arc(54.5,85.36) 55.94,88.85 55.94,97.88 94.93,98.01 94.93,84.04 ; 56,8.93 55.95,0 94.93,0 94.93,23.9 74.8,23.9 arc(71.3,25.35) 69.86,28.84 69.86,28.86 69.85,68.99 arc(71.3,72.49) 74.79,73.94 ; 56,8.93 56,8.92 ; 74.79,73.94 74.8,73.94 ; 74.79,73.94 94.93,73.91 94.93,83.91
Stack: Top Layer 0.035mm / Dielectric1 1.51mm FR4 er 4.5 / Bottom Layer 0.035mm

## Design rules (mm)
template: JLCPCB Capability(Two Layers Board)
spacing copperThickness1oz (default): track to track 0.102, other pairs 0.152 to 0.3
spacing copperThickness2oz: track to track 0.203, other pairs 0.152 to 0.3
track width copperThickness1oz (default): min 0.127, default 0.254, max 2.54
track width copperThickness2oz: min 0.203, default 0.254, max 2.54
differential pair differentialPair (default): width min 0.127, default 0.254, max 2.54; gap min 0.152, default 0.152
via viaSize (default): diameter min 0.5, default 0.61, max 10; hole min 0.3, default 0.305, max 6.3

## Placement (name value [footprint] x y rotation side)
DC1  DC050-T  [DC-IN_DC050-T]  61.66 48.99 180 top
HA1  -  [HDR1X1 长圆形]  60.77 2.5 90 top
HA2  -  [HDR1X1 长圆形]  70.29 2.5 90 top
HB1  -  [HDR1X1 长圆形]  90.19 2.5 90 top
HB2  -  [HDR1X1 长圆形]  80.71 2.5 90 top
LA1  -  [HDR1X1 长圆形]  90.11 95.34 90 top
LA2  -  [HDR1X1 长圆形]  80.84 95.34 90 top
LB1  -  [HDR1X1 长圆形]  60.64 95.47 90 top
LB2  -  [HDR1X1 长圆形]  70.17 95.34 90 top
U4  NRF24L01  [nrf24l01]  -0.06 14.06 0 top
U6  OLED 0.96  [OLED_0.96_IIC_1]  -0.06 83.91 270 top
U26  -  [TB6612]  62.93 17.11 135 top
U27  -  [TB6612]  63.31 80.61 225 top
U29  -  [STM32F103C8T6]  27.11 43.78 0 top

## Footprints (pads in the part's own frame, mm; a bottom-side part is the same pattern mirrored in y, then rotated)
DC-IN_DC050-T
  rect 2.5x2.5 smd: 1(-3.15,5.75) 1(3.15,5.75) 2(-2.828,-5.75) 3(3.026,-5.724)
HDR1X1 长圆形
  oval 1.498x3.048 hole 0.914: 1(0,0)
nrf24l01
  round 1.7 hole 0.914: 1(-15.337,-11.079) 2(-15.337,-8.539) 3(-15.337,-5.999) 4(-15.337,-3.459) 5(-17.877,-11.079) 6(-17.877,-8.539) 7(-17.877,-5.999) 8(-17.877,-3.459)
OLED_0.96_IIC_1
  round 1.524 hole 0.914: 1(8.636,24.765) 2(11.176,24.765) 3(13.716,24.765) 4(16.256,24.765)
STM32F103C8T6
  rect 1.575x1.575 hole 0.889: 1(23.749,7.874) 21(23.749,-7.366)
  round 1.575 hole 0.889: 2(21.209,7.874) 3(18.669,7.874) 4(16.129,7.874) 5(13.589,7.874) 6(11.05,7.872) 7(8.509,7.874) 8(5.969,7.874) 9(3.429,7.874) 10(0.889,7.874) 11(-1.651,7.874) 12(-4.191,7.874) 13(-6.731,7.874) 14(-9.271,7.874) 15(-11.811,7.874) 16(-14.351,7.874) 17(-16.891,7.874) 18(-19.431,7.874) 18(-19.431,7.874) 19(-21.971,7.874) 20(-24.511,7.874) 22(21.209,-7.366) 23(18.669,-7.366) 24(16.129,-7.366) 25(13.589,-7.366) 26(11.049,-7.366) 27(8.509,-7.366) 28(5.969,-7.366) 29(3.429,-7.366) 30(0.889,-7.366) 31(-1.651,-7.366) 32(-4.191,-7.366) 33(-6.731,-7.366) 34(-9.271,-7.366) 35(-11.811,-7.366) 36(-14.351,-7.366) 37(-16.891,-7.366) 38(-19.431,-7.366) 39(-21.971,-7.366) 40(-24.511,-7.366)
TB6612
  round 1.524 hole 0.914: 1(-4.064,8.636) 2(-4.064,6.096) 3(-4.064,3.556) 4(-4.064,1.016) 5(-4.064,-1.524) 6(-4.064,-4.064) 7(-4.064,-6.604) 8(-4.064,-9.144) 9(11.049,8.636) 10(11.049,6.096) 11(11.049,3.556) 12(11.049,1.016) 13(11.049,-1.524) 14(11.049,-4.064) 15(11.049,-6.604) 16(11.049,-9.144)

## Nets
+5V: U26.2 U27.2 U29.18
+12V: DC1.1 U26.1 U27.1
GND: DC1.2 DC1.3 U4.2 U6.2 U26.3 U26.8 U26.9 U27.3 U27.8 U27.9 U29.19 U29.21 U29.22
VCC: U4.1 U6.1 U29.20 U29.23 U29.40
CER: U4.4 U29.28
CSKR: U4.6 U29.31
CSLD: U6.3 U29.16
CSNR: U4.3 U29.32
HA01: HA1.1 U26.4
HA02: HA2.1 U26.5
HAIN1: U26.14 U29.8
HAIN2: U26.15 U29.9
HB01: HB1.1 U26.7
HB02: HB2.1 U26.6
HBIN1: U26.12 U29.6
HBIN2: U26.11 U29.5
HPWMA: U26.16 U29.36
HPWMB: U26.10 U29.35
HSTBY: U26.13 U29.7
IRQR: U4.7 U29.27
LA01: LA1.1 U27.4
LA02: LA2.1 U27.5
LAIN1: U27.14 U29.14
LAIN2: U27.15 U29.15
LB01: LB1.1 U27.7
LB02: LB2.1 U27.6
LBIN1: U27.12 U29.12
LBIN2: U27.11 U29.11
LPWMA: U27.16 U29.34
LPWMB: U27.10 U29.33
LSTBY: U27.13 U29.13
MISOR: U4.8 U29.30
MOSIR: U4.5 U29.29
SDAD: U6.4 U29.17

Pads without a net: U29 1 2 3 4 10 24 25 26 37 38 39

## Via types
v1: diameter 0.61, hole 0.305, Top Layer to Bottom Layer, 20 vias

## Routing (per net, layer and track width the routed paths; a pad name or vN(x,y) marks a point on that pad's centre or on a via; arc(x,y) is an arc through that point)
+5V: length 175.4
  Top Layer w0.254: U26.2 61.49,5.89 60.64,5.04 58.74,5.04 57.85,5.93 57.85,10.76 54.04,14.57 30.8,14.57 28.51,16.86 20.51,16.86 9.08,28.29 9.08,50.26 U29.18 7.68,62.07 16.95,71.34 32.45,71.34 42.23,81.12 58.61,81.12 60.9,78.83 70.15,78.83 U27.2
GND: length 238.7
  Top Layer w0.254: U27.9 61.6,74.82 55.82,80.61 44.26,80.61 v1(36.39,72.74) ; v1(54.17,35.02) 52.77,36.41 U29.21 50.86,46.94 DC1.3 ; 26.94,18.1 48.29,18.1 U26.9
  Top Layer w0.762: DC1.3 64.46,54.71 DC1.2 64.49,63.81 U27.9
  Bottom Layer w0.254: v1(54.17,35.02) 54.17,32.6 49.01,27.45 U26.9 ; U29.22 U29.21 ; U29.19 5.14,63.34 14.54,72.74 U6.2 v1(36.39,72.74)
  Bottom Layer w1.016: U26.3 63.29,16.58 67.41,20.7 U26.8
  Bottom Layer w1.27: U26.3 56.19,18.82 U26.9 ; U27.9 61.6,73.87 arc(63.64,78.85) 68.57,80.97 arc(68.63,80.97) U27.3 arc(62.35,83.6) U27.8
VCC: length 128.3
  Top Layer w0.254: 26.94,15.56 25.74,14.37 5.53,14.42 2.6,17.34 U29.40
  Bottom Layer w0.254: U29.23 45.78,34.41 26.94,15.56 ; U29.40 U29.20 2.6,64.35 13.53,75.28 U6.1
CER: length 15.8
  Top Layer w0.254: U29.28 33.08,29.33 26.94,23.18
CSKR: length 20.1
  Top Layer w0.254: 24.4,18.1 22.92,19.57 22.92,28.41 25.59,31.08 25.59,36.29 U29.31
CSLD: length 23.5
  Bottom Layer w0.254: U6.3 12.76,58.26 U29.16
CSNR: length 23.1
  Top Layer w0.254: v1(29.53,31.97) 30.04,31.97 v1(31.94,30.06)
  Bottom Layer w0.254: 26.94,20.64 31.94,25.65 v1(31.94,30.06) ; U29.32 27.37,31.97 v1(29.53,31.97)
HA01: length 12.8
  Top Layer w0.762: U26.4 65.08,6.82 HA1.1
HA02: length 13.4
  Top Layer w1.016: 70.27,2.55 arc(69.54,9.19) U26.5
HAIN1: length 37.1
  Top Layer w0.254: U29.8 42.99,41.75 v1(42.99,40.35) 45.02,38.32 46.29,38.32 47.05,37.56 47.05,35.02 v1(48.32,33.75) ; v1(50.48,33.75) 52.04,33.75 U26.14
  Bottom Layer w0.254: v1(48.32,33.75) v1(50.48,33.75)
HAIN2: length 40.9
  Top Layer w0.254: v1(41.59,38.7) 41.59,40.6 U29.9 ; U26.15 59.79,32.06 v1(53.15,38.7)
  Bottom Layer w0.254: v1(41.59,38.7) v1(53.15,38.7)
HB01: length 25.5
  Top Layer w1.016: 90.19,2.69 U26.7
HB02: length 19
  Top Layer w1.016: HB2.1 arc(80.64,2.63) 80.57,2.75 arc(75.2,10.41) U26.6
HBIN1: length 44.2
  Top Layer w0.254: U26.12 55.4,23.21 57.47,23.21 60.26,26 60.26,27.27 57.85,29.68 57.85,32.6 52.51,37.94 v1(52.51,39.46) ; U29.6 44.51,45.3 v1(44.51,44.16) v1(48.96,39.72)
  Bottom Layer w0.254: v1(48.96,39.72) 52.26,39.72 v1(52.51,39.46)
HBIN2: length 34.2
  Top Layer w0.254: U29.5 49.59,42.76 49.59,33.07 52.6,30.06 U26.11
HPWMA: length 60.6
  Top Layer w0.254: U26.16 61.58,33.32 v1(52.77,42.13) ; U29.36 12.76,41.62 14.54,43.4
  Bottom Layer w0.254: v1(14.67,43.4) 51.5,43.4 52.64,42.26
HPWMB: length 51.1
  Top Layer w0.254: v1(16.57,40.48) 15.3,39.21 U29.35 ; v1(39.43,31.08) 49.9,20.61 U26.10
  Bottom Layer w0.254: v1(39.43,31.08) 39.43,38.06 37.02,40.48 v1(16.57,40.48)
HSTBY: length 36
  Top Layer w0.254: U29.7 44.13,43.14 v1(44.13,42) 44.77,42 v1(48.7,38.06) ; 55.82,31.46 55.82,31.71 v1(53.02,34.51)
  Bottom Layer w0.254: v1(48.7,38.06) 51.37,38.06 52.13,37.3 52.13,35.4 v1(53.02,34.51) ; U26.13 56.19,30.99 v1(55.82,31.37)
IRQR: length 22.7
  Top Layer w0.254: U29.27 35.62,28.03 29.53,21.94 25.69,21.94 24.4,20.64
LA01: length 27.3
  Top Layer w1.27: LA1.1 85.04,90.28 arc(76.72,84.72) U27.4
LA02: length 19.5
  Top Layer w1.27: 81.09,95.34 77.28,91.02 arc(71.75,86.99) 65.36,84.56
LAIN1: length 49.7
  Bottom Layer w0.254: U29.14 26.1,59.91 45.4,59.91 52.51,67.02 52.51,75.56 U27.14
LAIN2: length 51.6
  Bottom Layer w0.254: U29.15 25.46,61.81 44.39,61.81 50.74,68.16 50.74,77.38 U27.15
LB01: length 8.1
  Top Layer w1.27: 61.77,88.28 62.4,88.91 62.4,94.72 arc(62.15,95.34) 61.53,95.6
LB02: length 11.6
  Top Layer w1.27: U27.6 68.66,91.71 arc(69.78,93.38) LB2.1
LBIN1: length 46.4
  Bottom Layer w0.254: U27.12 56.32,71.97 56.32,64.48 48.32,56.48 27.75,56.48 U29.12
LBIN2: length 44.7
  Bottom Layer w0.254: U29.11 28.64,54.83 50.1,54.83 58.01,62.74 U27.11
LPWMA: length 62
  Top Layer w0.254: U29.34 18.99,37.56 18.99,59.91 20,60.92 30.69,60.92 U27.16
LPWMB: length 64.9
  Top Layer w0.254: U29.33 20.38,43.4 21.65,44.67 21.65,58.51 22.03,58.89 50.21,58.89 U27.10
LSTBY: length 48
  Bottom Layer w0.254: U29.13 26.73,58 46.67,58 54.42,65.75 U27.13
MISOR: length 14.7
  Top Layer w0.254: U29.30 28,30.95 24.4,27.35 24.4,23.18
MOSIR: length 23.4
  Bottom Layer w0.254: 24.4,15.56 25.72,16.88 25.72,26.25 30.54,31.08 U29.29
SDAD: length 26.5
  Top Layer w0.254: U29.17 10.22,60.8 17.08,67.66 U6.4
+12V: length 79.9
  Top Layer w1.27: DC1.1 64.42,43.24 arc(64.53,43.28) 64.58,43.4 arc(67.36,44.55) 68.52,47.34 68.52,66.89 arc(69.36,72.51) U27.1 ; U26.1 59.7,13.7 arc(60.29,16.43) 62.17,18.51 arc(64.37,23.04) 65.09,28.03 DC1.1
